# Altium project LED Strip Board.PrjPcb
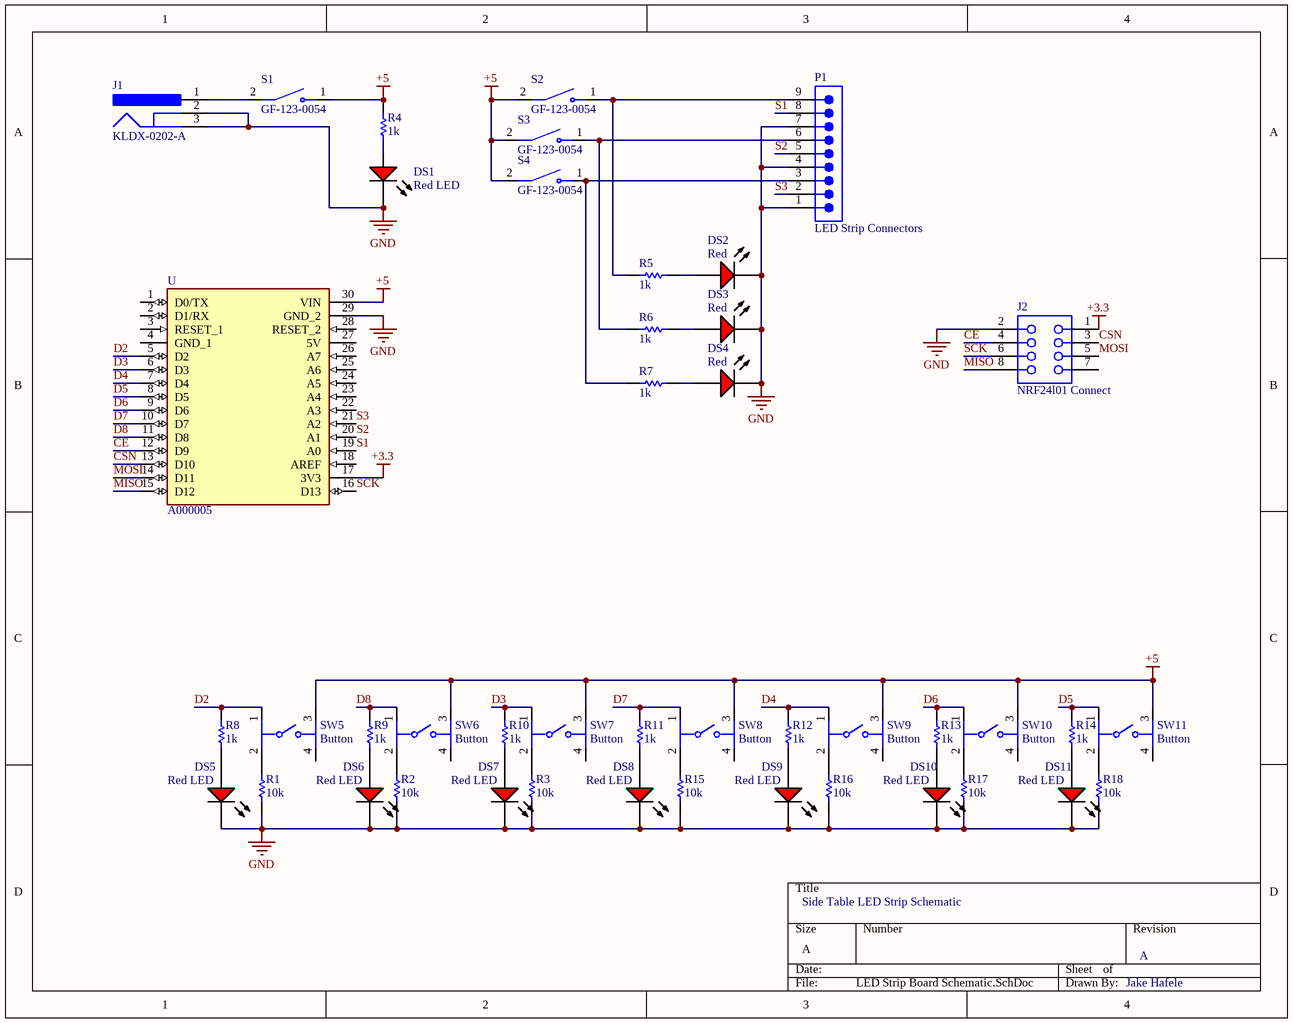
[diagram p0: LED Strip Board Schematic.SchDoc]
1 sheet, 44 parts. Net scope: global (net labels, ports and power ports of the same name join across sheets).
Board file: LED Strip Board 2.PcbDoc

## Sheet LED Strip Board Schematic.SchDoc
size A

### Parts
DS1  Red LED  [VISH-TLMS1000_V]
DS2  Red  [VISH-TLMS1000_V]
DS3  Red  [VISH-TLMS1000_V]
DS4  Red  [VISH-TLMS1000_V]
DS5  Red LED  [VISH-TLMS1000_V]
DS6  Red LED  [VISH-TLMS1000_V]
DS7  Red LED  [VISH-TLMS1000_V]
DS8  Red LED  [VISH-TLMS1000_V]
DS9  Red LED  [VISH-TLMS1000_V]
DS10  Red LED  [VISH-TLMS1000_V]
DS11  Red LED  [VISH-TLMS1000_V]
J1  KLDX-0202-A  [KYCN-KLDX-0202-A_V]
J2  NRF24l01 Connect  [SMTC-SSW-104-01-X-D]
P1  LED Strip Connectors  [SMTC-TSM-109-01-X-SV]
R1  10k  [RESC2013X70X40ML20T20]
R2  10k  [RESC2013X70X40ML20T20]
R3  10k  [RESC2013X70X40ML20T20]
R4  1k  [RESC2013X60X30ML20T20]
R5  1k  [RESC2013X60X30ML20T20]
R6  1k  [RESC2013X60X30ML20T20]
R7  1k  [RESC2013X60X30ML20T20]
R8  1k  [RESC2013X60X30ML20T20]
R9  1k  [RESC2013X60X30ML20T20]
R10  1k  [RESC2013X60X30ML20T20]
R11  1k  [RESC2013X60X30ML20T20]
R12  1k  [RESC2013X60X30ML20T20]
R13  1k  [RESC2013X60X30ML20T20]
R14  1k  [RESC2013X60X30ML20T20]
R15  10k  [RESC2013X70X40ML20T20]
R16  10k  [RESC2013X70X40ML20T20]
R17  10k  [RESC2013X70X40ML20T20]
R18  10k  [RESC2013X70X40ML20T20]
S1  GF-123-0054  [SW_GF-123-0054]
S2  GF-123-0054  [SW_GF-123-0054]
S3  GF-123-0054  [SW_GF-123-0054]
S4  GF-123-0054  [SW_GF-123-0054]
SW5  Button  [FP-1825910-2-0]
SW6  Button  [FP-1825910-2-0]
SW7  Button  [FP-1825910-2-0]
SW8  Button  [FP-1825910-2-0]
SW9  Button  [FP-1825910-2-0]
SW10  Button  [FP-1825910-2-0]
SW11  Button  [FP-1825910-2-0]
U  A000005  [MODULE_A000005]

### Nets
+3.3: J2.1 U.17(3V3)
+5: R4.2 S1.1 S2.2 S3.2 S4.2 SW5.3 SW6.3 SW7.3 SW8.3 SW9.3 SW10.3 SW11.3 U.30(VIN)
GND: DS1.2(K) DS2.2(K) DS3.2(K) DS4.2(K) DS5.2(K) DS6.2(K) DS7.2(K) DS8.2(K) DS9.2(K) DS10.2(K) DS11.2(K) J1.2 J1.3 J2.2 P1.1 P1.4 P1.7 R1.2 R2.2 R3.2 R15.2 R16.2 R17.2 R18.2 U.29(GND_2)
CE: J2.4 U.12(D9)
CSN: J2.3 U.13(D10)
D2: R8.2 SW5.1 U.5(D2)
D3: R10.2 SW7.1 U.6(D3)
D4: R12.2 SW9.1 U.7(D4)
D5: R14.2 SW11.1 U.8(D5)
D6: R13.2 SW10.1 U.9(D6)
D7: R11.2 SW8.1 U.10(D7)
D8: R9.2 SW6.1 U.11(D8)
MISO: J2.8 U.15(D12)
MOSI: J2.5 U.14(D11)
S1: P1.8 U.19(A0)
S2: P1.5 U.20(A1)
S3: P1.2 U.21(A2)
SCK: J2.6 U.16(D13)
NetDS1_1: DS1.1(A) R4.1
NetDS2_1: DS2.1(A) R5.1
NetDS3_1: DS3.1(A) R6.1
NetDS4_1: DS4.1(A) R7.1
NetDS5_1: DS5.1(A) R8.1
NetDS6_1: DS6.1(A) R9.1
NetDS7_1: DS7.1(A) R10.1
NetDS8_1: DS8.1(A) R11.1
NetDS9_1: DS9.1(A) R12.1
NetDS10_1: DS10.1(A) R13.1
NetDS11_1: DS11.1(A) R14.1
NetJ1_1: J1.1 S1.2
NetP1_3: P1.3 R7.2 S4.1
NetP1_6: P1.6 R6.2 S3.1
NetP1_9: P1.9 R5.2 S2.1
NetR1_1: R1.1 SW5.2
NetR2_1: R2.1 SW6.2
NetR3_1: R3.1 SW7.2
NetR15_1: R15.1 SW8.2
NetR16_1: R16.1 SW9.2
NetR17_1: R17.1 SW10.2
NetR18_1: R18.1 SW11.2

Not connected (* = marked no-connect by the designer): J2 7; SW5 4; SW6 4; SW7 4; SW8 4; SW9 4; SW10 4; SW11 4; U 1(D0/TX) 2(D1/RX) 3(RESET_1) 4(GND_1) 18(AREF) 22(A3) 23(A4) 24(A5) 25(A6) 26(A7) 27(5V) 28(RESET_2)

### Notes on the sheet
- Side Table LED Strip Schematic
- A
- Jake Hafele

### Library data of the parts
DS1-DS11 = CMP-2000-07254-1: Low Current LED, 40 mW, 1.8 V, -40 to 100 degC, 2-Pin SMD (0603), RoHS, Tape and Reel; Manufacturer: Vishay; Lens Shape: Rectangular; Automotive Qualification Standard: AEC-Q100; Wavelength Typ: 636nm; SVHC: ToBeAdvised; Bulb Size: 1.6mmx0.8mm; Forward Voltage: 1.8V; Luminous Intensity: 4mcd; Forward Current If: 2mA; Viewing Angle: 80°; Datasheet Version: Rev. 1.7, 02/2011; Datasheet URL: https://datasheet.ciiva.com/5798/1698881-5798337.pdf; LED Mounting: SMD; Packaging: CutTape; Package Reference: TLMS1000; Manufacturer URL: http://www.vishay.com/; Mounting Technology: SurfaceMount; Product Range: -; LED Colour: Red; Package Description: 2-Pin Surface Mount Device, Body 1.6 x 0.8 mm; MSL: MSL2-1year
J1 = CMP-1673-00001-5: DC Power Jack, 24 V, 3.5 A, -25 to 85 degC, 3-Pin THD, RoHS; Manufacturer: Kycon; Voltage Rating: 24 V; Current Rating: 3.5 A; Height: 10.8 mm; Length: 9.2 mm; Pins: 2; Housing Material: PBT; Connector Type: Power; ComponentLink2URL: http://www.kycon.com/Pub_Eng_Draw/KLDX-0202-X.PDF; PackageDescription: 3-Pin Through Hole Device, Body 14.5 x 9 mm; Max Operating Temperature: 85 degC; Min Operating Temperature: -25 degC; PackageReference: KLDX-0202-A; Contact Gender: Female; Package Quantity: 500; Mount: Through Hole; Colour: Black; Contact Plating: Tin; DatasheetVersion: Rev. D3, 06/2013; ComponentLink2Description: Datasheet; RoHSCompliant: true; Mounting Technology: Through Hole; ComponentLink1Description: Manufacturer URL; Contact Material: Brass; ComponentLink1URL: http://www.kycon.com/
J2 = CMP-1023-00339-1: SQ Post Socket, Through-hole, Vertical, -55 to 105 degC, 2.54mm Pitch, 8-Pin, Female, RoHS; PartNumber: SSW-104-01-T-D; Manufacturer: Samtec; ComponentLink1Description: Manufacturer URL; ComponentLink3Description: Package Specification; ComponentLink2Description: Datasheet; DatasheetVersion: F-214; PackageDescription: Assembly, Socket Strip .016 X .031 Tail; ComponentLink3URL: http://www.samtec.com/documents/webfiles/cpdf/SSW-1XX-XX-XXX-X-XX-XXX-XX-MKT.pdf; PackageReference: SSW-104-01-X-D; PackageVersion: CA, 6/1987; ComponentLink1URL: http://www.samtec.com; ComponentLink2URL: http://www.samtec.com/documents/webfiles/pdf/SSW_TH.PDF; Temperature Range: -55 to 105 degC; Orientation: Vertical; RoHS: True; Mounting Technology: Through-hole; Pitch: 2.54 mm
P1 = CMP-1024-00281-1: 0.025" SQ Post Header, Surface Mount, Vertical, -55 to 125 degC, 2.54 mm Pitch, 9-Pin, Male, RoHS; Manufacturer: Samtec; PartNumber: TSM-109-01-L-SV; Pitch: 2.54 mm; Temperature Range: -55 to 125 degC; PackageDescription: Single Row .100 SMT Assembly; Orientation: Vertical; ComponentLink1URL: http://www.samtec.com; PackageReference: TSM-109-01-X-SV; ComponentLink2URL: http://www.samtec.com/documents/webfiles/pdf/TSM.PDF; ComponentLink2Description: Datasheet; RoHS: True; ComponentLink1Description: Manufacturer URL; ComponentLink3Description: Package Specification; Mounting Technology: Surface Mount; ComponentLink3URL: http://www.samtec.com/documents/webfiles/cpdf/TSM-1XX-XX-XXX-SV-XX-XXX-XX-MKT.pdf; DatasheetVersion: F-214; PackageVersion: BP, 8/2002
R1-R3 R15-R18 = CMP-2001-04376-1: Manufacturer: Panasonic; Part Number: ERJ-6ENF1002V
R4-R14 = CMP-2001-04656-1: Part Number: RK73B2ATTD102J; Manufacturer: KOA Speer
S1-S4 = GF-123-0054: Slide Switch SPST Through Hole; MF: CW Industries; MP: GF-123-0054; SnapEDA_Link: https://www.snapeda.com/parts/GF-123-0054/CW%20Industries/view-part/2176135/?ref=snap; Check_prices: https://www.snapeda.com/parts/GF-123-0054/CW%20Industries/view-part/2176135/?ref=eda; Price: None; Availability: Good; Purchase-URL: https://pricing.snapeda.com/search/part/GF-123-0054/?ref=eda; Package: None; Value: *
SW5-SW11 = CMP-03407-000004-1: SWITCH TACTILE SPST-NO 0.05A 24V; Manufacturer: TE; Manufacturer Part Number: 1825910-2; Contact Current Rating: 50mA; Operating Force: 160gf; Contact Resistance: 100mΩ; Electromechanical Life: 100000Cycles; Package: 0; ComponentLink2Description: Datasheet; Digikey Description: SWITCH TACTILE SPST-NO 0.05A 24V; Octopart: https://octopart.com/1825910-2-te+connectivity-42270502; Temperature Range Low: -35°C; Temperature Range High: +85°C; Lead Free: Yes; Device Class L2: Switches; Automotive: No; Temperature: -35°C to +85°C; Device Class L1: Electromechanical; Category: Switch; ComponentLink2URL: https://www.te.com/commerce/DocumentDelivery/DDEController?Action=showdoc&DocId=Customer+Drawing%7F1825910%7FC10%7Fpdf%7FEnglish%7FENG_CD_1825910_C10.pdf%7F1825910-2; Mount: Through Hole; RoHS: TRUE; Height: 4.6mm; Device Class L3: Tactile Switches; Voltage Rating Dc: 24V; Throw Configuration: SPST-NO
U = A000005: CLOCK SAW OSCILLATOR SEAM7050 T&; MF: Arduino; MP: A000005; Value: *; Digi-Key_Purchase_URL: https://www.digikey.com/product-detail/en/diodes-incorporated/SPA000005J/SPA000005J-ND/9769570?utm_source=snapeda&utm_medium=aggregator&utm_campaign=symbol; SnapEDA_Link: https://www.snapeda.com/parts/A000005/Arduino/view-part/51027/?ref=snap; Digi-Key_Part_Number: SPA000005J-ND; Package: None